# EAGLE design art_limb (EAGLE 7.6.0)
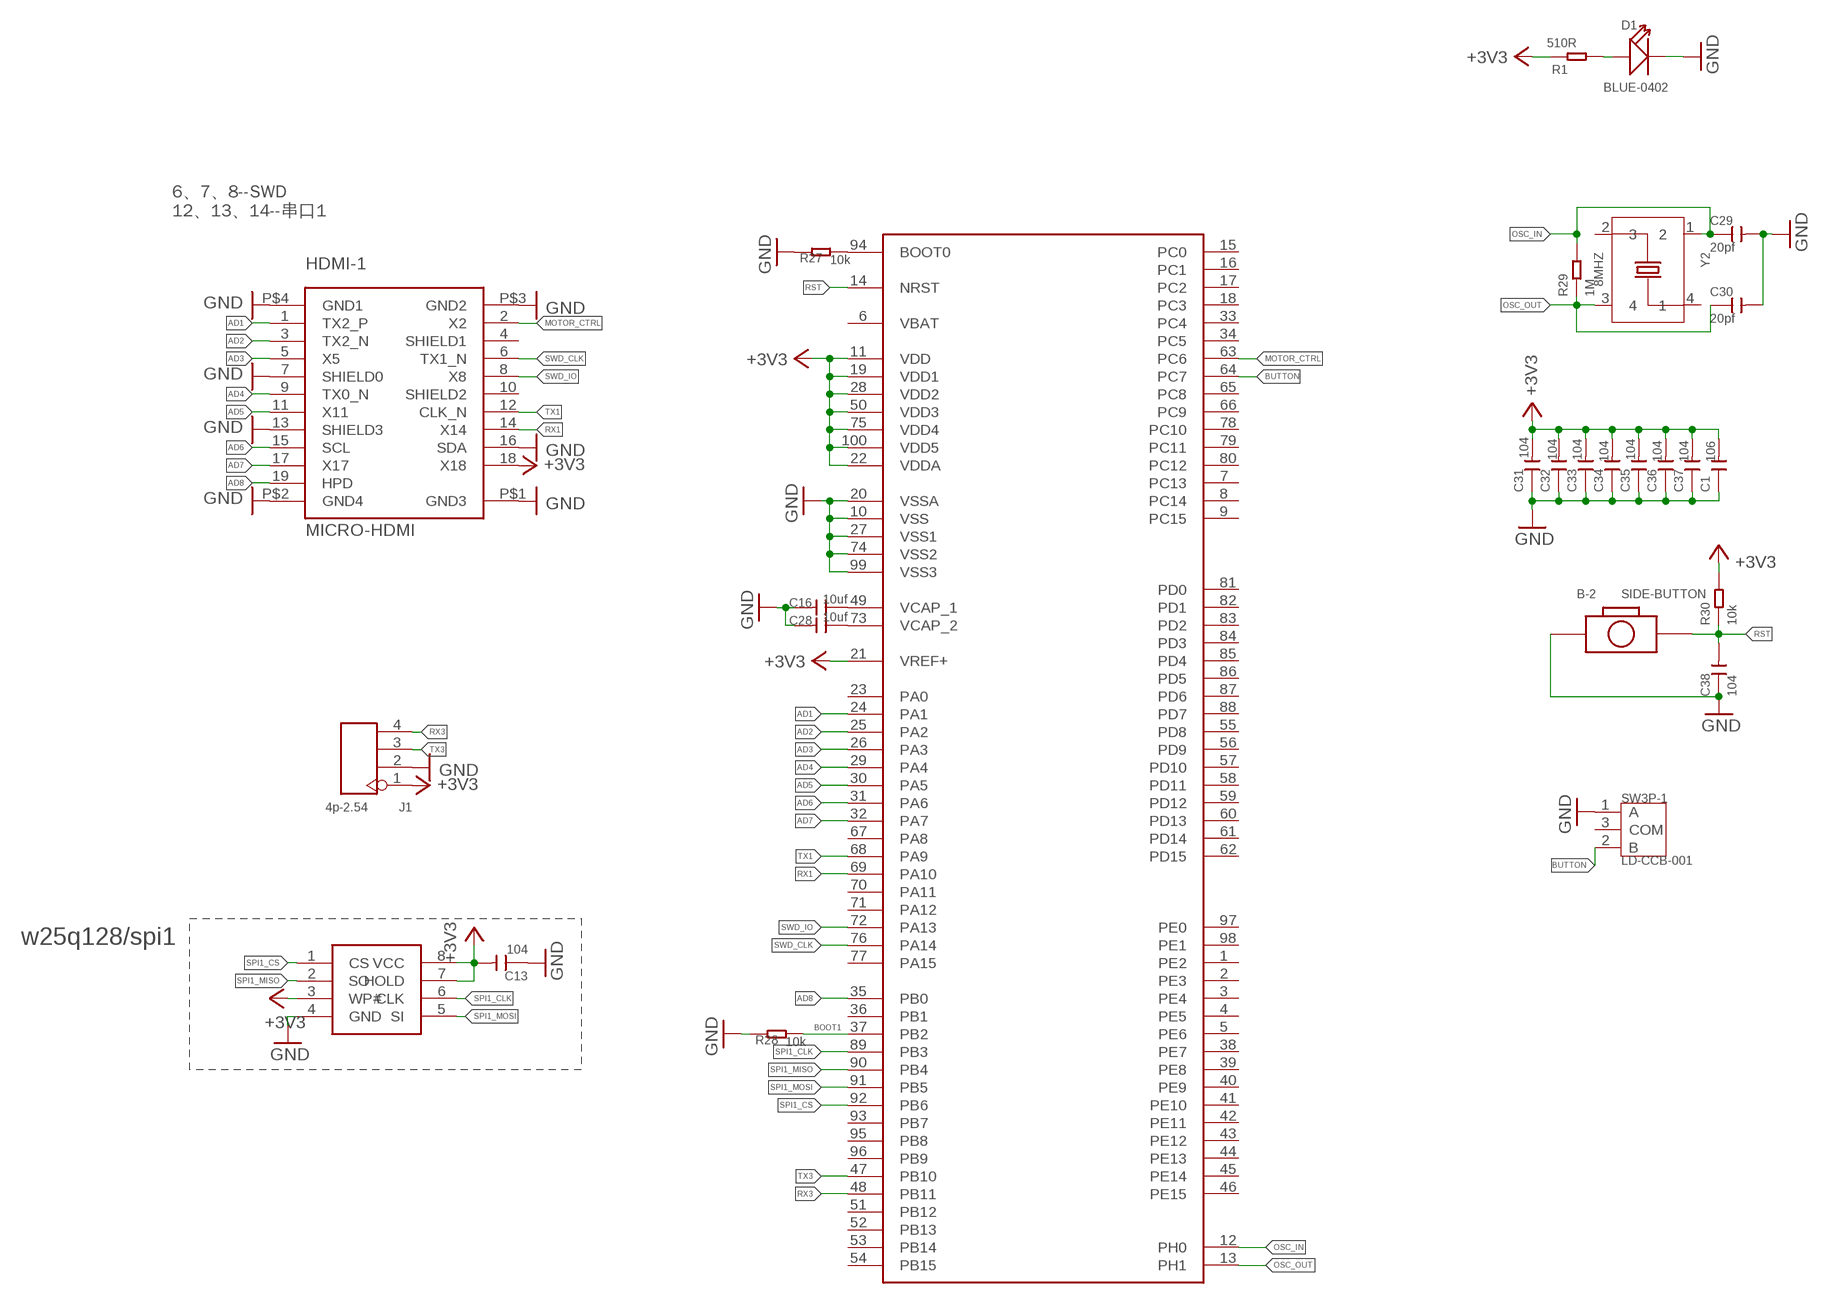
[diagram p0: schematic, sheet 1]

## Parts
B-2  SIDE-BUTTON  [SIDE-BUTTON]
C1  106  CAP-(0402)  [C0402]
C13  104  CAP-(0402)  [C0402]
C16  10uf  CAP-(0402)  [C0402]
C28  10uf  CAP-(0402)  [C0402]
C29  20pf  CAP-(0402)  [C0402]
C30  20pf  CAP-(0402)  [C0402]
C31  104  CAP-(0402)  [C0402]
C32  104  CAP-(0402)  [C0402]
C33  104  CAP-(0402)  [C0402]
C34  104  CAP-(0402)  [C0402]
C35  104  CAP-(0402)  [C0402]
C36  104  CAP-(0402)  [C0402]
C37  104  CAP-(0402)  [C0402]
C38  104  CAP-(0402)  [C0402]
D1  BLUE-0402  LED-(0402)  [LED-0402]
HDMI-1  MICRO-HDMI  [HDMI]
J1  4p-2.54  DIP-BLACK-FEMALE-HEADER-VERT(4P-2.54)  [H4-2.54]
R1  510R  RES-(0402)  [R0402]
R27  10k  RES-(0402)  [R0402]
R28  10k  RES-(0402)  [R0402]
R29  1M  RES-(0402)  [R0402]
R30  10k  RES-(0402)  [R0402]
SW3P-1  LD-CCB-001  SWITCH(3P)  [SW3-2.54-9.0X3.5X3.5+2.0MM]
U$1  STM32F40XSTM32D40X  [LQFP100]
W25Q128  W25Q128  [SOP08]
Y2  8MHZ  SMD-CRYSTAL-27.12MHZ-18PF-30PPM-60R(4P-3.2X2.5MM)  [X4-SMD-3.2X2.5X0.7MM]

## Nets
+3V3: C1.2 C13.2 C31.2 C32.2 C33.2 C34.2 C35.2 C36.2 C37.2 HDMI-1.18(X18) J1.1 R1.2 R30.2 U$1.11(VDD) U$1.19(VDD1) U$1.21(VREF+) U$1.22(VDDA) U$1.28(VDD2) U$1.50(VDD3) U$1.75(VDD4) U$1.100(VDD5) W25Q128.3(WP#) W25Q128.7(HOLD) W25Q128.8(VCC)
AD1: HDMI-1.1(TX2_P) U$1.24(PA1)
AD2: HDMI-1.3(TX2_N) U$1.25(PA2)
AD3: HDMI-1.5(X5) U$1.26(PA3)
AD4: HDMI-1.9(TX0_N) U$1.29(PA4)
AD5: HDMI-1.11(X11) U$1.30(PA5)
AD6: HDMI-1.15(SCL) U$1.31(PA6)
AD7: HDMI-1.17(X17) U$1.32(PA7)
AD8: HDMI-1.19(HPD) U$1.35(PB0)
BOOT1: R28.2 U$1.37(PB2)
BUTTON: SW3P-1.2(B) U$1.64(PC7)
GND: B-2.P$2 C1.1 C13.1 C16.2 C28.2 C29.2 C30.2 C31.1 C32.1 C33.1 C34.1 C35.1 C36.1 C37.1 C38.1 D1.- HDMI-1.7(SHIELD0) HDMI-1.13(SHIELD3) HDMI-1.16(SDA) HDMI-1.P$1(GND3) HDMI-1.P$2(GND4) HDMI-1.P$3(GND2) HDMI-1.P$4(GND1) J1.2 R27.1 R28.1 SW3P-1.1(A) U$1.10(VSS) U$1.20(VSSA) U$1.27(VSS1) U$1.74(VSS2) U$1.99(VSS3) W25Q128.4(GND)
MOTOR_CTRL: HDMI-1.2(X2) U$1.63(PC6)
N$1: D1.+ R1.1
N$21: C16.1 U$1.49(VCAP_1)
N$22: C28.1 U$1.73(VCAP_2)
N$23: R27.2 U$1.94(BOOT0)
OSC_IN: C29.1 R29.2 U$1.12(PH0) Y2.1
OSC_OUT: C30.1 R29.1 U$1.13(PH1) Y2.3
RST: B-2.P$1 C38.2 R30.1 U$1.14(NRST)
RX1: HDMI-1.14(X14) U$1.69(PA10)
RX3: J1.4 U$1.48(PB11)
SPI1_CLK: U$1.89(PB3) W25Q128.6(CLK)
SPI1_CS: U$1.92(PB6) W25Q128.1(CS)
SPI1_MISO: U$1.90(PB4) W25Q128.2(SO)
SPI1_MOSI: U$1.91(PB5) W25Q128.5(SI)
SWD_CLK: HDMI-1.6(TX1_N) U$1.76(PA14)
SWD_IO: HDMI-1.8(X8) U$1.72(PA13)
TX1: HDMI-1.12(CLK_N) U$1.68(PA9)
TX3: J1.3 U$1.47(PB10)
Unconnected: HDMI-1.4(SHIELD1) HDMI-1.10(SHIELD2) SW3P-1.3(COM) U$1.1(PE2) U$1.2(PE3) U$1.3(PE4) U$1.4(PE5) U$1.5(PE6) U$1.6(VBAT) U$1.7(PC13) U$1.8(PC14) U$1.9(PC15) U$1.15(PC0) U$1.16(PC1) U$1.17(PC2) U$1.18(PC3) U$1.23(PA0) U$1.33(PC4) U$1.34(PC5) U$1.36(PB1) U$1.38(PE7) U$1.39(PE8) U$1.40(PE9) U$1.41(PE10) U$1.42(PE11) U$1.43(PE12) U$1.44(PE13) U$1.45(PE14) U$1.46(PE15) U$1.51(PB12) U$1.52(PB13) U$1.53(PB14) U$1.54(PB15) U$1.55(PD8) U$1.56(PD9) U$1.57(PD10) U$1.58(PD11) U$1.59(PD12) U$1.60(PD13) U$1.61(PD14) U$1.62(PD15) U$1.65(PC8) U$1.66(PC9) U$1.67(PA8) U$1.70(PA11) U$1.71(PA12) U$1.77(PA15) U$1.78(PC10) U$1.79(PC11) U$1.80(PC12) U$1.81(PD0) U$1.82(PD1) U$1.83(PD2) U$1.84(PD3) U$1.85(PD4) U$1.86(PD5) U$1.87(PD6) U$1.88(PD7) U$1.93(PB7) U$1.95(PB8) U$1.96(PB9) U$1.97(PE0) U$1.98(PE1) Y2.2 Y2.4

## Notes on the sheet
- 6、7、8--SWD
  12、13、14--串口1
- w25q128/spi1

## Library data of the parts
B-2 = 1-LDA_Board:SIDE-BUTTON
C1 C13 C16 C28-C38 = 1-LDA_Board:CAP-(0402): 302010041; MPN: GRM1555C1H150JA01D; VALUE: 15pf
D1 = 1-LDA_Board:LED-(0402): 304090075; MPN: BL-HB337A-AV-TRB
HDMI-1 = 1-LDA_Board:MICRO-HDMI
J1 = Seeed-OPL-Connector:DIP-BLACK-FEMALE-HEADER-VERT(4P-2.54): 320030017; MPN: F185-1104A1BSYA1
R1 R27-R30 = 1-LDA_Board:RES-(0402): 301010000; MPN: RC0402JR-070RL; VALUE: 0R
SW3P-1 = 1-LDA_Board:SWITCH(3P): 311030006; MPN: LD-CCB-001
U$1 = 1-LDA_Board:STM32F40X: Features • Core: ARM 32-bit Cortex™-M4 CPU with FPU, Adaptive real-time accelerator (ART Accelerator™) allowing 0-wait state execution from Flash memory, frequency up to 168 MHz, memory protection unit, 210 DMIPS/ 1.25 DMIPS/MHz (Dhrystone 2.1), and DSP instructions • Memories – Up to 1 Mbyte of Flash memory – Up to 192+4 Kbytes of SRAM including 64- Kbyte of CCM (core coupled memory) data RAM – Flexible static memory controller supporting Compact Flash, SRAM, PSRAM, NOR and NAND memories • LCD parallel interface, 8080/6800 modes • Clock, reset and supply management – 1.8 V to 3.6 V application supply and I/Os – POR, PDR, PVD and BOR – 4-to-26 MHz crystal oscillator – Internal 16 MHz factory-trimmed RC (1% accuracy) – 32 kHz oscillator for RTC with calibration – Internal 32 kHz RC with calibration • Low power – Sleep, Stop and Standby modes – VBAT supply for RTC, 20×32 bit backup registers + optional 4 KB backup SRAM • 3×12-bit, 2.4 MSPS A/D converters: up to 24 channels and 7.2 MSPS in triple interleaved mode • 2×12-bit D/A converters • General-purpose DMA: 16-stream DMA controller with FIFOs and burst support • Up to 17 timers: up to twelve 16-bit and two 32- bit timers up to 168 MHz, each with up to 4 IC/OC/PWM or pulse counter and quadrature (incremental) encoder input • Debug mode – Serial wire debug (SWD) & JTAG interfaces – Cortex-M4 Embedded Trace Macrocell™ • Up to 140 I/O ports with interrupt capability – Up to 136 fast I/Os up to 84 MHz – Up to 138 5 V-tolerant I/Os • Up to 15 communication interfaces – Up to 3 × I2C interfaces (SMBus/PMBus) – Up to 4 USARTs/2 UARTs (10.5 Mbit/s, ISO 7816 interface, LIN, IrDA, modem control) – Up to 3 SPIs (42 Mbits/s), 2 with muxed full-duplex I2S to achieve audio class accuracy via internal audio PLL or external clock – 2 × CAN interfaces (2.0B Active) – SDIO interface • Advanced connectivity – USB 2.0 full-speed device/host/OTG controller with on-chip PHY – USB 2.0 high-speed/full-speed device/host/OTG controller with dedicated DMA, on-chip full-speed PHY and ULPI – 10/100 Ethernet MAC with dedicated DMA: supports IEEE 1588v2 hardware, MII/RMII • 8- to 14-bit parallel camera interface up to 54 Mbytes/s • True random number generator • CRC calculation unit • 96-bit unique ID • RTC: subsecond accuracy, hardware calendar
W25Q128 = 1-LDA_Board:W25Q128
Y2 = 1-LDA_Board:SMD-CRYSTAL-27.12MHZ-18PF-30PPM-60R(4P-3.2X2.5MM): 306010027; MPN: 7M-27.120MAAJ-T; VALUE: 27.12MHZ

## Board
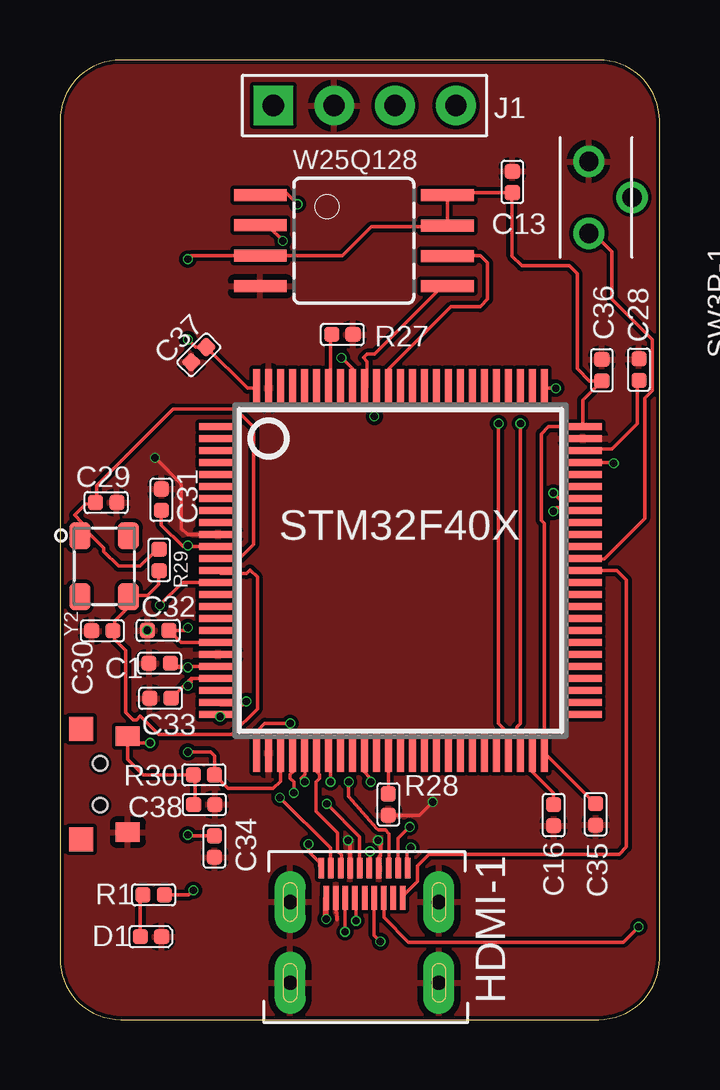
[diagram p1: board, top side]
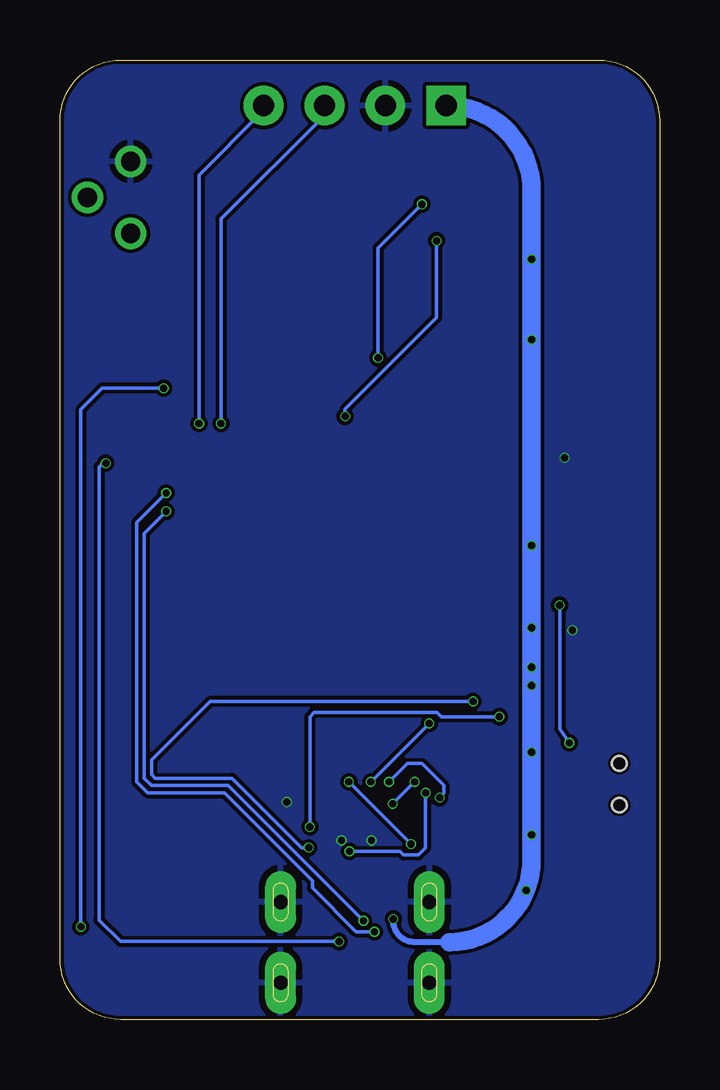
[diagram p2: board, bottom side, seen from below]

Size 25 x 40 mm. Coordinates in mm from the lower left corner, seen from the top.
Outline: 25,2.54 25,37.46 arc90 22.46,40 2.54,40 arc90 0,37.46 0,2.54 arc90 2.54,0 22.46,0 arc90 25,2.54
Copper layers (1*16): Top 0.035mm / dielectric 1.5mm / Bottom 0.035mm
Design rules "default *": minimum track width 6mil, minimum drill 12mil, track to track 6mil, track to pad 6mil, pad to pad 6mil, via to via 6mil, smd to smd 6mil, copper to edge 6mil, drill to drill 8mil, minimum pad ring 10mil, minimum via ring 2mil, stop-mask expansion 4mil, vias tented up to drill 12mil, thermal gap 10mil

### Footprints (pad centres in the part's own frame; a part is rotated, then mirrored left to right if it is on the bottom)
SIDE-BUTTON = smd 0.8 x 1: P$1 -2,1.15; P$2 2,1.15 | smd 1 x 1: P$3 2.3,-0.8; P$4 -2.3,-0.8 | hole 0.6: 0.87,0; -0.87,0
C0402 = smd 0.635 x 0.635: 1 0,0.445; 2 0,-0.445
LED-0402 = smd 0.635 x 0.635: + -0.445,0; - 0.445,0
HDMI = smd 0.23 x 0.85: 1 1.8,1.225; 3 1.4,1.225; 5 1,1.225; 7 0.6,1.225; 9 0.2,1.225; 11 -0.2,1.225; 13 -0.6,1.225; 15 -1,1.225; 17 -1.4,1.225; 19 -1.8,1.225 | smd 0.23 x 1: 2 1.6,0; 4 1.2,0; 6 0.8,0; 8 0.4,0; 10 0,0; 12 -0.4,0; 14 -0.8,0; 16 -1.2,0; 18 -1.6,0 | drill 0.6 pad 1.3 long: P$1 -3.1,-0.18; P$2 3.1,-0.18; P$3 -3.1,-3.55; P$4 3.1,-3.55
H4-2.54 = drill 0.889 pad 1.651 square: 1 0,3.81 | drill 0.889 pad 1.651: 2 0,1.27; 3 0,-1.27; 4 0,-3.81
R0402 = smd 0.635 x 0.635: 1 0,0.445; 2 0,-0.445
SW3-2.54-9.0X3.5X3.5+2.0MM = drill 0.8 pad 1.3: 1 -1.5,-1.8; 2 1.5,-1.8 | drill 0.8: 3 0,0
LQFP100 = smd 1.6 x 0.3: 1 -7.6,6; 2 -7.6,5.5; 3 -7.6,5; 4 -7.6,4.5; 5 -7.6,4; 6 -7.6,3.5; 7 -7.6,3; 8 -7.6,2.5; 9 -7.6,2; 10 -7.6,1.5; 11 -7.6,1; 12 -7.6,0.5; 13 -7.6,0; 14 -7.6,-0.5; 15 -7.6,-1; 16 -7.6,-1.5; 17 -7.6,-2; 18 -7.6,-2.5; 19 -7.6,-3; 20 -7.6,-3.5; 21 -7.6,-4; 22 -7.6,-4.5; 23 -7.6,-5; 24 -7.6,-5.5; 25 -7.6,-6; 51 7.6,-6; 52 7.6,-5.5; 53 7.6,-5; 54 7.6,-4.5; 55 7.6,-4; 56 7.6,-3.5; 57 7.6,-3; 58 7.6,-2.5; 59 7.6,-2; 60 7.6,-1.5; 61 7.6,-1; 62 7.6,-0.5; 63 7.6,0; 64 7.6,0.5; 65 7.6,1; 66 7.6,1.5; 67 7.6,2; 68 7.6,2.5; 69 7.6,3; 70 7.6,3.5; 71 7.6,4; 72 7.6,4.5; 73 7.6,5; 74 7.6,5.5; 75 7.6,6 | smd 0.3 x 1.6: 26 -6,-7.6; 27 -5.5,-7.6; 28 -5,-7.6; 29 -4.5,-7.6; 30 -4,-7.6; 31 -3.5,-7.6; 32 -3,-7.6; 33 -2.5,-7.6; 34 -2,-7.6; 35 -1.5,-7.6; 36 -1,-7.6; 37 -0.5,-7.6; 38 0,-7.6; 39 0.5,-7.6; 40 1,-7.6; 41 1.5,-7.6; 42 2,-7.6; 43 2.5,-7.6; 44 3,-7.6; 45 3.5,-7.6; 46 4,-7.6; 47 4.5,-7.6; 48 5,-7.6; 49 5.5,-7.6; 50 6,-7.6; 76 6,7.6; 77 5.5,7.6; 78 5,7.6; 79 4.5,7.6; 80 4,7.6; 81 3.5,7.6; 82 3,7.6; 83 2.5,7.6; 84 2,7.6; 85 1.5,7.6; 86 1,7.6; 87 0.5,7.6; 88 0,7.6; 89 -0.5,7.6; 90 -1,7.6; 91 -1.5,7.6; 92 -2,7.6; 93 -2.5,7.6; 94 -3,7.6; 95 -3.5,7.6; 96 -4,7.6; 97 -4.5,7.6; 98 -5,7.6; 99 -5.5,7.6; 100 -6,7.6
SOP08 = smd 0.5 x 2.2: 1 -1.905,-3.9; 2 -0.645,-3.9; 3 0.625,-3.9; 4 1.895,-3.9; 5 1.905,3.9; 6 0.635,3.9; 7 -0.635,3.9; 8 -1.905,3.9
X4-SMD-3.2X2.5X0.7MM = smd 1.143 x 0.889: 1 -1.27,-1.016; 2 1.27,-1.016; 3 1.27,1.016; 4 -1.27,1.016

### Placement (x,y rotation side)
B-2  1.68,9.81 270 top
C1  4.16,14.85 90 top
C13  18.87,34.92 0 top
C16  20.59,8.52 0 top
C28  24.14,27.09 180 top
C29  1.93,21.55 90 top
C30  1.77,16.2 270 top
C31  4.23,21.67 0 top
C32  4.09,16.22 90 top
C33  4.19,13.39 90 top
C34  6.44,7.21 180 top
C35  22.33,8.55 180 top
C36  22.6,27.07 0 top
C37  5.79,27.71 135 top
C38  6.02,8.96 270 top
D1  3.8,3.45 0 top
HDMI-1  12.7,5.08 0 top
J1  12.7,38.1 90 top
R1  3.9,5.2 90 top
R27  11.78,28.56 270 top
R28  13.69,8.96 180 top
R29  4.14,19.16 180 top
R30  6,10.2 90 top
SW3P-1  23.85,34.27 270 top
U$1  14.2,18.71 0 top
W25Q128  12.25,32.47 270 top
Y2  1.84,18.9 270 top

### Tracks (layer width: path | path; a pad name or v marks a point on that pad's centre or on a via)
+3V3  (via drill 0.3 pad 0.41)
  Top 0.152: U$1.11 5.33,19.71 | C31.2 4.22,21.21 4.22,20.62 5.13,19.71 5.33,19.71 | U$1.19 5.04,15.71 C32.2 5.22,16.22 v5.33,16.33 | U$1.21 4.74,14.71 C1.2 4.6,14.68 v5.33,14.68 | U$1.22 5.46,14.21 | 5.46,14.21 C33.2 | 5.33,19.71 v5.33,19.76 | 5.46,14.21 5.46,14.04 v5.33,13.92 | v5.33,31.7 5.48,31.84 W25Q128.3 11.78,31.84 12.98,33.05 16.09,33.05 W25Q128.7 W25Q128.8 16.25,34.47 C13.2 18.85,34.45 18.85,31.83 19.25,31.42 21.23,31.42 21.57,31.09 21.57,27.13 22.07,26.62 C36.2 21.8,25.83 U$1.75 20.37,24.71 20.07,24.41 20.07,20.8 20.2,20.67 U$1.50 22.31,9 C35.2 | v5.33,28.35 5.65,28.03 C37.2 7.82,26.31 U$1.100 | R1.2 5.37,5.2 v5.56,5.38 | C34.2 5.37,7.66 v5.33,7.7 | U$1.28 9.2,9.94 8.89,9.63 7.02,9.63 R30.2 6.44,10.98 6.27,11.15 v5.33,11.15
  Top 0.254: v11.1,4.19 HDMI-1.18 | HDMI-1.18 arc-90 HDMI-1.18
  Bottom 0.152: v5.56,5.38 5.64,5.33 5.61,5.32
  Bottom 0.254: 8.76,3.23 10.21,3.23 arc90 11.1,4.12 v11.1,4.19
  Bottom 0.762: J1.1 arc90 5.33,34.54 v5.33,31.7 v5.33,28.35 v5.33,19.76 v5.33,16.33 v5.33,14.68 v5.33,13.92 v5.33,11.15 v5.33,7.7 5.33,6.66 arc23 5.61,5.32 arc67 8.76,3.23
AD1  (via drill 0.3)
  Top 0.152: v14.63,7.16 14.48,7.01 14.48,6.4 HDMI-1.1 | v7.77,13.26 7.62,13.11 6.71,13.11 U$1.24
  Bottom 0.152: v14.63,7.16 14.94,7.16 17.83,10.06 21.03,10.06 21.18,10.21 21.18,10.82 18.75,13.26 v7.77,13.26
AD2  (via drill 0.3 pad 0.41)
  Top 0.152: HDMI-1.3 14.1,7.55 v14.58,8.03 | U$1.25 v6.68,12.62
  Bottom 0.152: v14.58,8.03 14.58,12.62 14.4,12.8 9.27,12.8 9.09,12.62 v6.68,12.62
AD3  (via drill 0.3)
  Top 0.152: v12.04,9.91 12.04,9.3 13.21,7.98 13.28,7.9 13.56,7.9 13.72,7.75 13.72,6.4 HDMI-1.5 | v9.6,12.34 8.53,12.34 8.23,12.04 8.23,11.12 U$1.26
  Bottom 0.152: v9.6,12.34 v12.04,9.91
AD4  (via drill 0.3)
  Top 0.152: v9.75,9.45 9.75,9.91 9.6,10.06 9.6,10.21 9.75,10.36 9.75,10.97 U$1.29 | v12.93,7.01 12.93,6.33 HDMI-1.9
  Bottom 0.152: v9.75,9.45 9.75,7.16 10.06,6.86 10.67,6.86 10.82,7.01 v12.93,7.01
AD5  (via drill 0.3)
  Top 0.152: v11.12,8.99 12.5,7.62 12.5,6.4 HDMI-1.11 | v10.21,9.91 10.06,10.06 10.21,10.21 10.21,10.97 U$1.30
  Bottom 0.152: v10.21,9.91 v11.12,8.99
AD6
  Top 0.152: HDMI-1.15 11.73,6.4 11.73,6.86 11.58,7.01 11.58,7.77 10.67,8.69 10.67,9.91 10.82,10.06 10.82,10.21 10.67,10.36 10.67,10.97 U$1.31
AD7  (via drill 0.3)
  Top 0.152: v9.17,9.25 11.28,7.16 11.28,6.4 HDMI-1.17 | v11.28,9.91 11.28,10.97 U$1.32
  Bottom 0.152: v9.17,9.25 8.99,9.45 8.99,9.75 9.91,10.67 10.52,10.67 v11.28,9.91
AD8  (via drill 0.3)
  Top 0.152: v10.36,7.32 10.36,7.01 10.82,6.55 10.82,6.4 HDMI-1.19 | v12.95,9.91 12.95,10.06 12.65,10.36 12.65,10.97 U$1.35
  Bottom 0.152: v12.95,9.91 v10.36,7.32
BOOT1
  Top 0.152: R28.2 U$1.37
BUTTON
  Top 0.152: U$1.64 21.95,19.2 22.71,19.2 24.38,20.88 24.38,25.91 24.69,26.21 24.69,28.35 23.01,30.02 23.01,32 22.1,32.92 SW3P-1.2
GND  (via drill 0.3 pad 0.41)
  Top 0.152: HDMI-1.16 11.5,4.48 11.56,4.42 11.56,4.17 | 13.3,7.43 v13.26,7.47 | HDMI-1.7 13.3,6.77 13.36,6.83 13.36,7.37 v13.26,7.47 | 13.41,7.32 v13.26,7.47 | HDMI-1.13 12.1,7.43 v12.01,7.47 | C32.1 v3.64,16.23 v3.63,16.23 | U$1.10 5.31,20.21 5.05,20.47 5.05,22.33 v3.96,23.42 | R28.1 15,8.52 v15.54,9.07
  pour Top: -3.96,42.98 30.76,42.98 30.76,-3.73 -3.96,-3.73
  pour Bottom: -2.24,42.06 28.3,42.06 28.3,-1.63 -2.24,-1.63
MOTOR_CTRL
  Top 0.152: U$1.63 23.22,18.71 23.62,18.31 23.62,7.19 23.32,6.88 15.39,6.88 14.91,6.4 14.91,5.77 14.3,5.16 HDMI-1.2
N$1
  Top 0.152: D1.+ 3.35,3.5 3.35,5.18 R1.1
N$21
  Top 0.152: C16.1 20.57,8.99 20.57,9.45 19.66,10.36 19.66,10.97 U$1.49
N$22
  Top 0.152: C28.1 24.08,26.52 24.08,24.84 23.01,23.77 21.95,23.77 U$1.73
N$23
  Top 0.152: R27.2 11.28,28.5 11.28,26.36 U$1.94
OSC_IN
  Top 0.152: 0.91,20.27 1.22,20.27 1.83,19.66 1.83,19.51 2.44,18.9 3.35,18.9 3.96,19.51 4.12,19.51 R29.2 | 0.91,20.27 0.91,20.73 0.61,21.03 1.07,21.49 1.37,21.49 C29.1 1.52,21.64 1.52,22.25 4.72,25.45 7.32,25.45 8.08,24.69 8.08,19.81 7.47,19.2 6.71,19.2 U$1.12 | 0.91,20.27 Y2.1
OSC_OUT
  Top 0.152: R29.1 4.12,18.59 4.12,18.14 3.66,17.68 2.9,17.68 Y2.3 2.74,17.53 2.74,17.07 2.29,16.61 2.29,16.31 C30.1 2.29,16.15 2.29,15.85 2.74,15.39 2.74,12.8 3.05,12.5 3.2,12.5 3.35,12.65 4.12,11.89 7.16,11.89 8.23,12.95 8.23,18.44 7.92,18.75 7.77,18.59 6.71,18.59 U$1.13
RST  (via drill 0.3 pad 0.41)
  Top 0.152: C38.2 5.64,8.99 5.64,10.06 R30.1 3.46,10.2 2.82,10.85 2.82,11.8 B-2.P$1 | U$1.14 5.11,18.21 v4.17,17.27 | 2.96,11.68 B-2.P$1 | v3.76,11.53 3.11,11.53 B-2.P$1
  Bottom 0.152: v4.17,17.27 4.17,12.12 v3.76,11.53
RX1  (via drill 0.3)
  Top 0.152: v11.89,3.66 11.89,5.03 HDMI-1.14 | v20.57,21.95 20.88,21.64 21.79,21.64 U$1.69
  Bottom 0.152: v11.89,3.66 12.65,3.66 14.48,5.49 14.48,5.79 18.14,9.45 21.34,9.45 21.79,9.91 21.79,20.73 v20.57,21.95
RX3  (via drill 0.3)
  Top 0.152: v19.2,24.84 19.2,12.34 19.05,12.19 19.05,12.04 19.2,11.89 19.2,11.12 U$1.48
  Bottom 0.152: v19.2,24.84 19.2,35.2 16.61,37.8 16.61,38.1 J1.4
SPI1_CLK
  Top 0.152: U$1.89 13.72,26.36 13.72,27.13 16.31,29.72 17.53,29.72 17.83,30.02 17.83,31.55 17.53,31.85 16.15,31.85 W25Q128.6
SPI1_CS  (via drill 0.3)
  Top 0.152: v11.73,27.58 12.19,27.13 12.19,26.36 U$1.92 | v9.91,33.98 9.45,34.44 8.38,34.44 W25Q128.1
  Bottom 0.152: v11.73,27.58 11.73,32.16 v9.91,33.98
SPI1_MISO  (via drill 0.3)
  Top 0.152: v13.11,25.15 13.11,26.21 U$1.90 | v9.3,32.46 8.69,33.07 8.38,33.07 W25Q128.2
  Bottom 0.152: v13.11,25.15 13.11,25.45 9.3,29.26 v9.3,32.46
SPI1_MOSI
  Top 0.152: U$1.91 12.8,26.36 12.8,27.43 12.65,27.58 12.8,27.74 13.11,27.74 16,30.63 W25Q128.5
SWD_CLK  (via drill 0.3 pad 0.41)
  Top 0.152: U$1.76 v20.68,26.31 | HDMI-1.6 13.5,4.25 14.53,3.23 23.5,3.23 v24.13,3.86
  Bottom 0.152: v20.68,26.31 23.24,26.31 24.13,25.43 v24.13,3.86
SWD_IO  (via drill 0.3 pad 0.41)
  Top 0.152: 13.11,5.03 HDMI-1.8 13.1,3.51 v13.36,3.25 | U$1.72 23.07,23.21 v23.09,23.19
  Bottom 0.152: v23.09,23.19 23.22,23.19 23.37,23.04 23.37,4.14 22.48,3.25 v13.36,3.25
TX1  (via drill 0.3)
  Top 0.152: v12.34,4.12 12.34,5.03 HDMI-1.12 | v20.57,21.18 20.73,21.34 20.88,21.34 21.03,21.18 21.79,21.18 U$1.68
  Bottom 0.152: v12.34,4.12 17.98,9.75 21.18,9.75 21.49,10.06 21.49,20.27 v20.57,21.18
TX3  (via drill 0.3)
  Top 0.152: v18.29,24.84 18.29,12.34 18.75,11.89 18.75,11.12 U$1.47
  Bottom 0.152: v18.29,24.84 18.29,33.38 14.02,37.64 14.02,38.1 J1.3

### Text on the board
tStop: Econ-Tech